# Altium schematic sheet peripheries.SchDoc
size A4
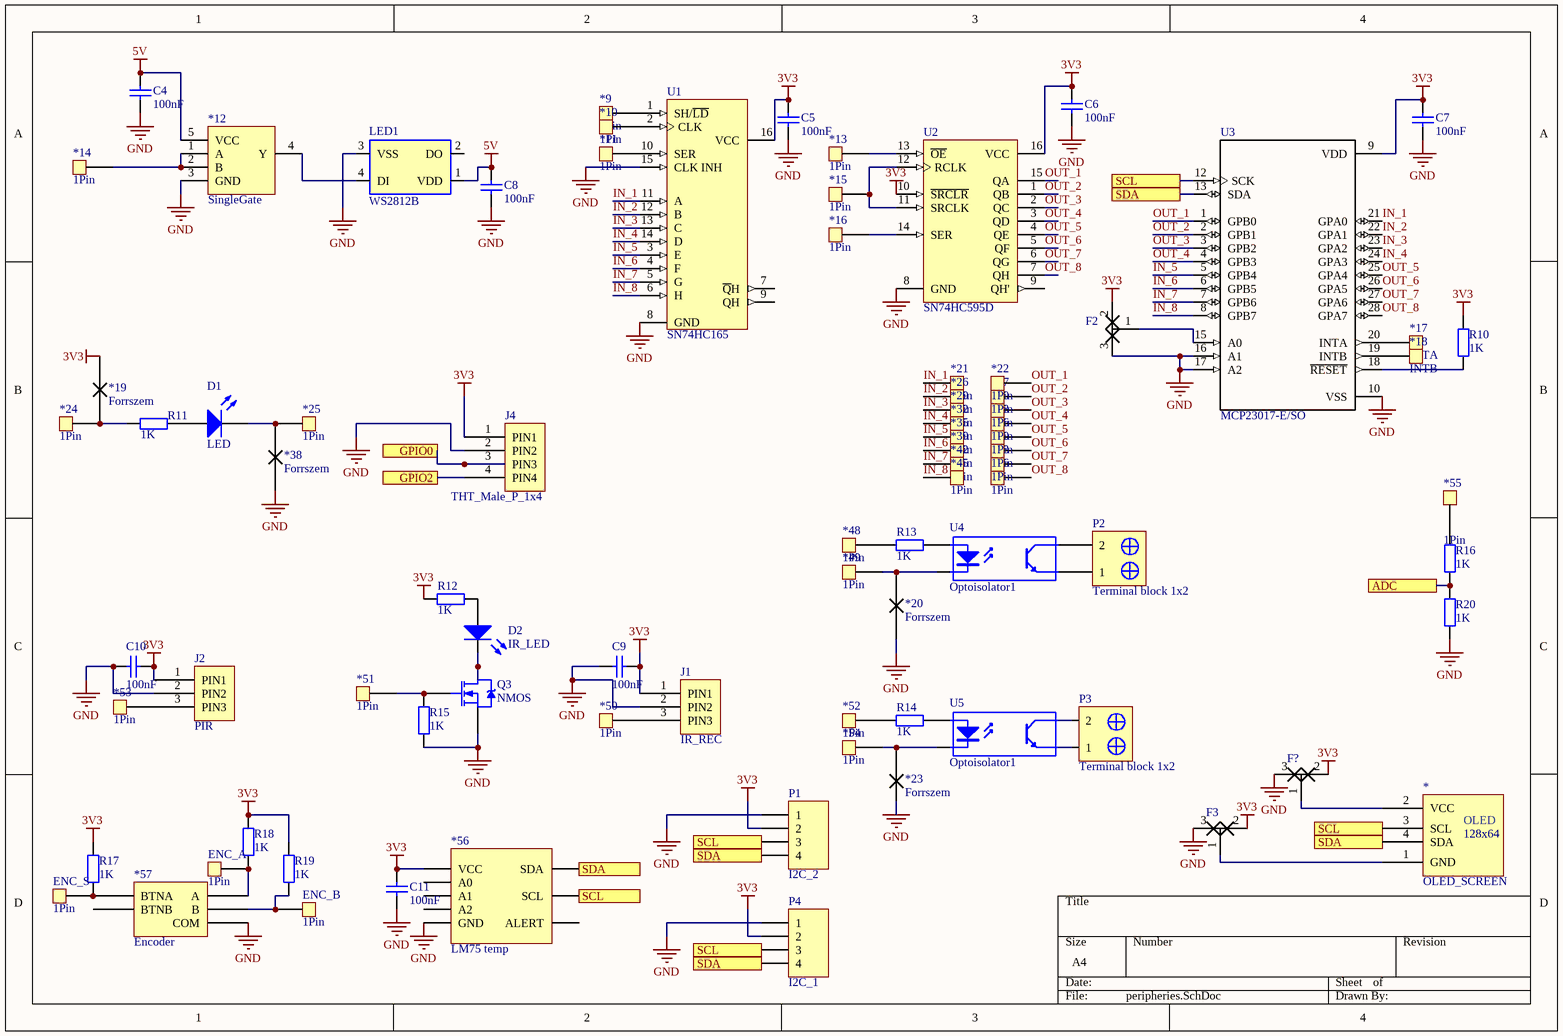
[diagram p0: peripheries.SchDoc]

## Parts
*  OLED_SCREEN  [SCREEN]
*9  1Pin  [Header1]
*10  1Pin  [Header1]
*11  1Pin  [Header1]
*12  SingleGate  [SOT23-5]
*13  1Pin  [Header1]
*14  1Pin  [Header1]
*15  1Pin  [Header1]
*16  1Pin  [Header1]
*17  INTA  [Header1]
*18  INTB  [Header1]
*19  Forrszem  [FORRSZEM]
*20  Forrszem  [FORRSZEM]
*21  1Pin  [Header1]
*22  1Pin  [Header1]
*23  Forrszem  [FORRSZEM]
*24  1Pin  [Header1]
*25  1Pin  [Header1]
*26  1Pin  [Header1]
*27  1Pin  [Header1]
*29  1Pin  [Header1]
*30  1Pin  [Header1]
*32  1Pin  [Header1]
*33  1Pin  [Header1]
*35  1Pin  [Header1]
*36  1Pin  [Header1]
*38  Forrszem  [FORRSZEM]
*39  1Pin  [Header1]
*40  1Pin  [Header1]
*42  1Pin  [Header1]
*43  1Pin  [Header1]
*45  1Pin  [Header1]
*46  1Pin  [Header1]
*48  1Pin  [Header1]
*49  1Pin  [Header1]
*50  1Pin  [Header1]
*51  1Pin  [Header1]
*52  1Pin  [Header1]
*53  1Pin  [Header1]
*54  1Pin  [Header1]
*55  1Pin  [Header1]
*56  LM75 temp  [SO8]
*57  Encoder  [Encoder]
C4  100nF  [FP_0805_CAP_085]
C5  100nF  [FP_0805_CAP_085]
C6  100nF  [FP_0805_CAP_085]
C7  100nF  [FP_0805_CAP_085]
C8  100nF  [FP_0805_CAP_085]
C9  100nF  [FP_0805_CAP_085]
C10  100nF  [FP_0805_CAP_085]
C11  100nF  [FP_0805_CAP_085]
D1  LED  [FP_0805_LED_RED]
D2  IR_LED  [FP_LED_TH_RED]
ENC_A  1Pin  [Header1]
ENC_B  1Pin  [Header1]
ENC_S  1Pin  [Header1]
F2  (no value)  [FORRSZEM3]
F3  Forrszem_2  [FORRSZEM3]  (value not drawn)
F?  Forrszem_2  [FORRSZEM3]  (value not drawn)
J1  IR_REC  [THT_Male_P_1x3-2.54mm]
J2  PIR  [THT_Male_P_1x3-2.54mm]
J4  THT_Male_P_1x4  [THT_Male_P_1x4-2.54mm]
LED1  WS2812B  [PLCC4-LED]
P1  I2C_2  [HDR1X4]
P2  Terminal block 1x2  [Sorkapolcs 1x2 3.5mm PCB]
P3  Terminal block 1x2  [Sorkapolcs 1x2 3.5mm PCB]
P4  I2C_1  [HDR1X4]
Q3  NMOS  [SOT95P245X110-3N]
R10  value 1K  [0805]  (hidden comment: Resistor)
R11  value 1K  [0805]  (hidden comment: Resistor)
R12  value 1K  [0805]  (hidden comment: Resistor)
R13  1K  [FP_0805_RES]
R14  1K  [FP_0805_RES]
R15  value 1K  [0805]  (hidden comment: Resistor)
R16  1K  [FP_0805_RES]
R17  1K  [FP_0805_RES]
R18  1K  [FP_0805_RES]
R19  1K  [FP_0805_RES]
R20  1K  [FP_0805_RES]
U1  SN74HC165  [D016_N]
U2  SN74HC595D  [D016_N]
U3  MCP23017-E/SO  [*SOIC127P1030X265-28N]
U4  Optoisolator1  [DIP-4]
U5  Optoisolator1  [DIP-4]

## Ports
ADC, GPIO0, GPIO2, SCL, SDA

## Nets
3V3: *19.2(B) *56.VCC C5.2 C6.2 C7.2 C9.1 C10.1 C11.2 F2.2(C) F3.2(C) F?.2(C) J1.1(PIN1) J2.1(PIN1) J4.1(PIN1) P1.2 P4.2 R10.1 R12.2 R17.2 R18.2 R19.2 U1.16(VCC) U2.10(~{SRCLR}) U2.16(VCC) U3.9(VDD)
5V: *12.5(VCC) C4.2 C8.2 LED1.1(VDD)
GND: *12.3(GND) *20.1(A) *23.1(A) *38.1(A) *56.GND *57.COM C4.1 C5.1 C6.1 C7.1 C8.1 C9.2 C10.2 C11.1 F2.3(A) F3.3(A) F?.3(A) J1.2(PIN2) J2.2(PIN2) J4.2(PIN2) LED1.3(VSS) P1.1 P4.1 Q3.S R15.1 R20.1 U1.8(GND) U1.15(CLK_INH) U2.8(GND) U3.10(VSS) U3.16(A1) U3.17(A2)
ADC: R16.1 R20.2 ; port ADC
GPIO0: J4.3(PIN3) ; port GPIO0
GPIO2: J4.4(PIN4) ; port GPIO2
IN_1: *21.1 U1.11(A) U3.21(GPA0)
IN_2: *26.1 U1.12(B) U3.22(GPA1)
IN_3: *29.1 U1.13(C) U3.23(GPA2)
IN_4: *32.1 U1.14(D) U3.24(GPA3)
IN_5: *35.1 U1.3(E) U3.5(GPB4)
IN_6: *39.1 U1.4(F) U3.6(GPB5)
IN_7: *42.1 U1.5(G) U3.7(GPB6)
IN_8: *45.1 U1.6(H) U3.8(GPB7)
OUT_1: *22.1 U2.15(QA) U3.1(GPB0)
OUT_2: *27.1 U2.1(QB) U3.2(GPB1)
OUT_3: *30.1 U2.2(QC) U3.3(GPB2)
OUT_4: *33.1 U2.3(QD) U3.4(GPB3)
OUT_5: *36.1 U2.4(QE) U3.25(GPA4)
OUT_6: *40.1 U2.5(QF) U3.26(GPA5)
OUT_7: *43.1 U2.6(QG) U3.27(GPA6)
OUT_8: *46.1 U2.7(QH) U3.28(GPA7)
SCL: *.3(SCL) *56.SCL P1.3 P4.3 U3.12(SCK) ; port SCL
SDA: *.4(SDA) *56.SDA P1.4 P4.4 U3.13(SDA) ; port SDA
Net*9_1: *9.1 U1.1(SH/~{LD})
Net*10_1: *10.1 U1.2(CLK)
Net*11_1: *11.1 U1.10(SER)
Net*12_1: *12.1(A) *12.2(B) *14.1
Net*12_4: *12.4(Y) LED1.4(DI)
Net*13_1: *13.1 U2.13(~{OE})
Net*15_1: *15.1 U2.11(SRCLK) U2.12(RCLK)
Net*16_1: *16.1 U2.14(SER)
Net*17_1: *17.1 U3.20(INTA)
Net*18_1: *18.1 U3.19(INTB)
Net*19_1: *19.1(A) *24.1 R11.1
Net*20_2: *20.2(B) *49.1 U4.2(K)
Net*23_2: *23.2(B) *54.1 U5.2(K)
Net*25_1: *25.1 *38.2(B) D1.2(K)
Net*48_1: *48.1 R13.2
Net*50_1: *50.1 J1.3(PIN3)
Net*51_1: *51.1 Q3.G R15.2
Net*52_1: *52.1 R14.2
Net*53_1: *53.1 J2.3(PIN3)
Net*55_1: *55.1 R16.2
Net*57_A: *57.A ENC_A.1 R18.1
Net*57_B: *57.B ENC_B.1 R19.1
Net*57_BTNA: *57.BTNA ENC_S.1 R17.1
Net*_1: *.1(GND) F3.1(B)
Net*_2: *.2(VCC) F?.1(B)
NetD1_1: D1.1(A) R11.2
NetD2_1: D2.1(A) R12.1
NetD2_2: D2.2(K) Q3.D
NetF2_1: F2.1(B) U3.15(A0)
NetP2_1: P2.1 U4.3(E)
NetP2_2: P2.2 U4.4(C)
NetP3_1: P3.1 U5.3(E)
NetP3_2: P3.2 U5.4(C)
NetR10_2: R10.2 U3.18(~{RESET})
NetR13_1: R13.1 U4.1(A)
NetR14_1: R14.1 U5.1(A)

Not connected (* = marked no-connect by the designer): *56 A0 A1 A2 ALERT; *57 BTNB; LED1 2(DO); U1 7(~{Q}H) 9(QH); U2 9(QH')

## Notes on the sheet
- (in symbol OLED_SCREEN) OLED; 128x64

## Library data of the parts
*17 *18 = 1Pin
*56 = LM75 temp: pin to pad: A0>7 A1>6 A2>5 ALERT>3 GND>4 SCL>2 SDA>1 VCC>8; Farnell: 8455970; Lomex: 56-04-14
C4-C11 = CAP: Capacitor; Value: 100nF
D1 D2 = LED: Typical RED GaAs LED; pin to pad: 1>A 2>K
F2 = Forrszem_2
J1 J2 = THT_Male_P_1x3: THT Male pin header strip 1x3
J4 = THT_Male_P_1x4: THT Male pin header strip 1x4
LED1 = WS2812B: WorldSemi WS2812B Smart RGB LED; 9.UnitCost: 0.15; 1.Manufacturer: WorldSemi; 2.MfgNo: WS2812B; 3.Supplier: WorldSemi; 4.CatNo: WS2812B
P1 P4 = Header 4: Header, 4-Pin; LatestRevisionDate: 17-Jul-2002; LatestRevisionNote: Re-released for DXP Platform.; Publisher: Altium Limited
P2 P3 = Sorkapocs PCB 1x2 3.5mm
Q3 = NMOS: N-Channel Power MOSFET; pin to pad: D>3 G>1 S>2; Note: Pin 2 is electrically connected to pin 4.; Published: 8-Jun-2000; LatestRevisionDate: 17-Jul-2002; LatestRevisionNote: Re-released for DXP Platform.; DatasheetDocument: PD-9.814; PackageReference: TO-220AB; Publisher: Altium Limited; Code_JEDEC: TO-220-AB; ComponentLink1Description: Manufacturer Link; ComponentLink1URL: http://www.irf.com/
R13 R14 R16-R20 = RES: Resistor; Value: 1K
U1 = SN74HC165: 8-Bit Parallel-Load Shift Register; Published: 8-Jun-2000; LatestRevisionDate: 13-Apr-2006; LatestRevisionNote: IPC-7351 Footprint Added.; DatasheetVersion: May-1997; PackageVersion: Jan-1998; PackageReference: D016; Publisher: Altium Limited; PackageDescription: 16-Pin Small Outline Integrated Circuit 1.27 mm Pitch; Code_IPC: SOIC127P600-16; ComponentLink1Description: Manufacturer Link; ComponentLink1URL: http://www.ti.com/; ComponentLink2Description: Datasheet; ComponentLink2URL: http://www-s.ti.com/sc/ds/sn74hc166.pdf
U2 = SN74HC595D: 8-Bit Shift Register with 3-State Output Registers; Published: 8-Jun-2000; LatestRevisionDate: 13-Apr-2006; LatestRevisionNote: IPC-7351 Footprint Added.; DatasheetVersion: May-1997; PackageVersion: Jan-1998; PackageReference: D016; Publisher: Altium Limited; PackageDescription: 16-Pin Small Outline Integrated Circuit 1.27 mm Pitch; Code_IPC: SOIC127P600-16; ComponentLink1Description: Manufacturer Link; ComponentLink1URL: http://www.ti.com/; ComponentLink2Description: Datasheet; ComponentLink2URL: http://www-s.ti.com/sc/ds/sn74hc595.pdf
U3 = MCP23017-E/SO: MCP23017 Series 5.5 V 1.7 MHz SMT 16-Bit I2C I/O Expander - SOIC-28; MF: Microchip; SnapEDA_Link: https://www.snapeda.com/parts/MCP23017-E/SO/Microchip/view-part/?ref=snap; Price: None; MP: MCP23017-E/SO; Availability: Unavailable; Package: SOIC-28 Microchip; Value: *
U4 U5 = Optoisolator1: 4-Pin Phototransistor Optocoupler; Published: 24-Mar-1999; LatestRevisionDate: 04-Mar-2005; LatestRevisionNote: Sch pins 3 & 4 Swapped.; DatasheetVersion: Nov-2003; PackageReference: DIP-4; Publisher: Altium Limited
R10-R12 R15 = Resistor: Published: 8-Jun-2000; LatestRevisionDate: 17-Jul-2002; LatestRevisionNote: Re-released for DXP Platform.; PackageReference: AXIAL-0.4; Publisher: Altium Limited